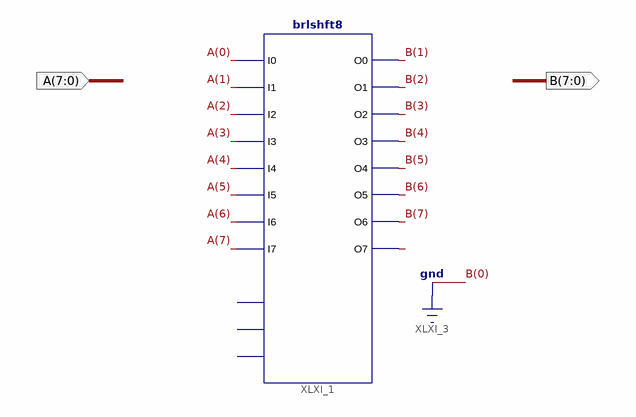
[diagram p0: schematic sheet 1]
// Xilinx ISE schematic myShifterTest.sch (spartan6) as structural Verilog: 1 symbols, 2 ports
module myShifterTest (
  input  [7:0] A,
  output [7:0] B
);

  wire XLXN_14;

  brlshft8 XLXI_1 (
    .I0(A[0]), .I1(A[1]), .I2(A[2]), .I3(A[3]), .I4(A[4]), .I5(A[5]), .I6(A[6]), .I7(A[7]), .O0(B[1]),
    .O1(B[2]), .O2(B[3]), .O3(B[4]), .O4(B[5]), .O5(B[6]), .O6(B[7]), .O7(XLXN_14));  // open: S0, S1, S2

  assign B[0] = 1'b0;
endmodule
